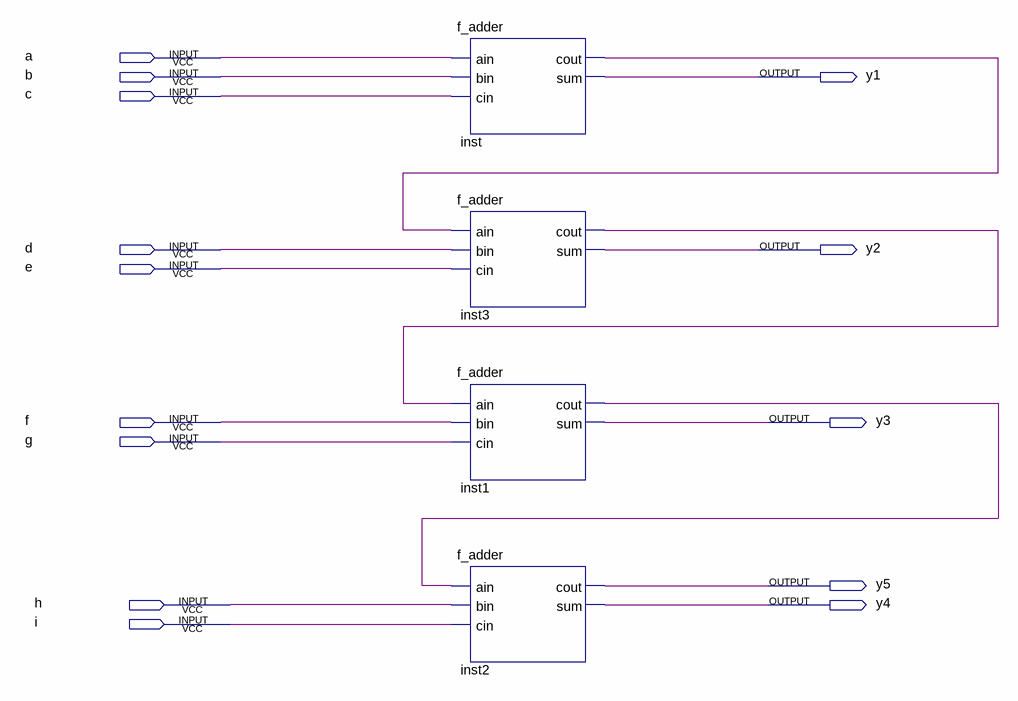
[diagram p0: schematic sheet]
// Quartus schematic four_full_adder.bdf as structural Verilog: 4 symbols, 14 pins
module four_full_adder (
  input  a,
  input  b,
  input  c,
  input  d,
  input  e,
  input  f,
  input  g,
  input  h,
  input  i,
  output y1,
  output y2,
  output y3,
  output y5,
  output y4
);

  wire inst1_cout, inst3_cout, inst_cout;

  f_adder inst (.ain(a), .bin(b), .cin(c), .cout(inst_cout), .sum(y1));
  f_adder inst3 (.ain(inst_cout), .bin(d), .cin(e), .cout(inst3_cout), .sum(y2));
  f_adder inst1 (.ain(inst3_cout), .bin(f), .cin(g), .cout(inst1_cout), .sum(y3));
  f_adder inst2 (.ain(inst1_cout), .bin(h), .cin(i), .cout(y5), .sum(y4));
endmodule
